# EAGLE design Rauchmelder 2.2 (EAGLE 6.2)
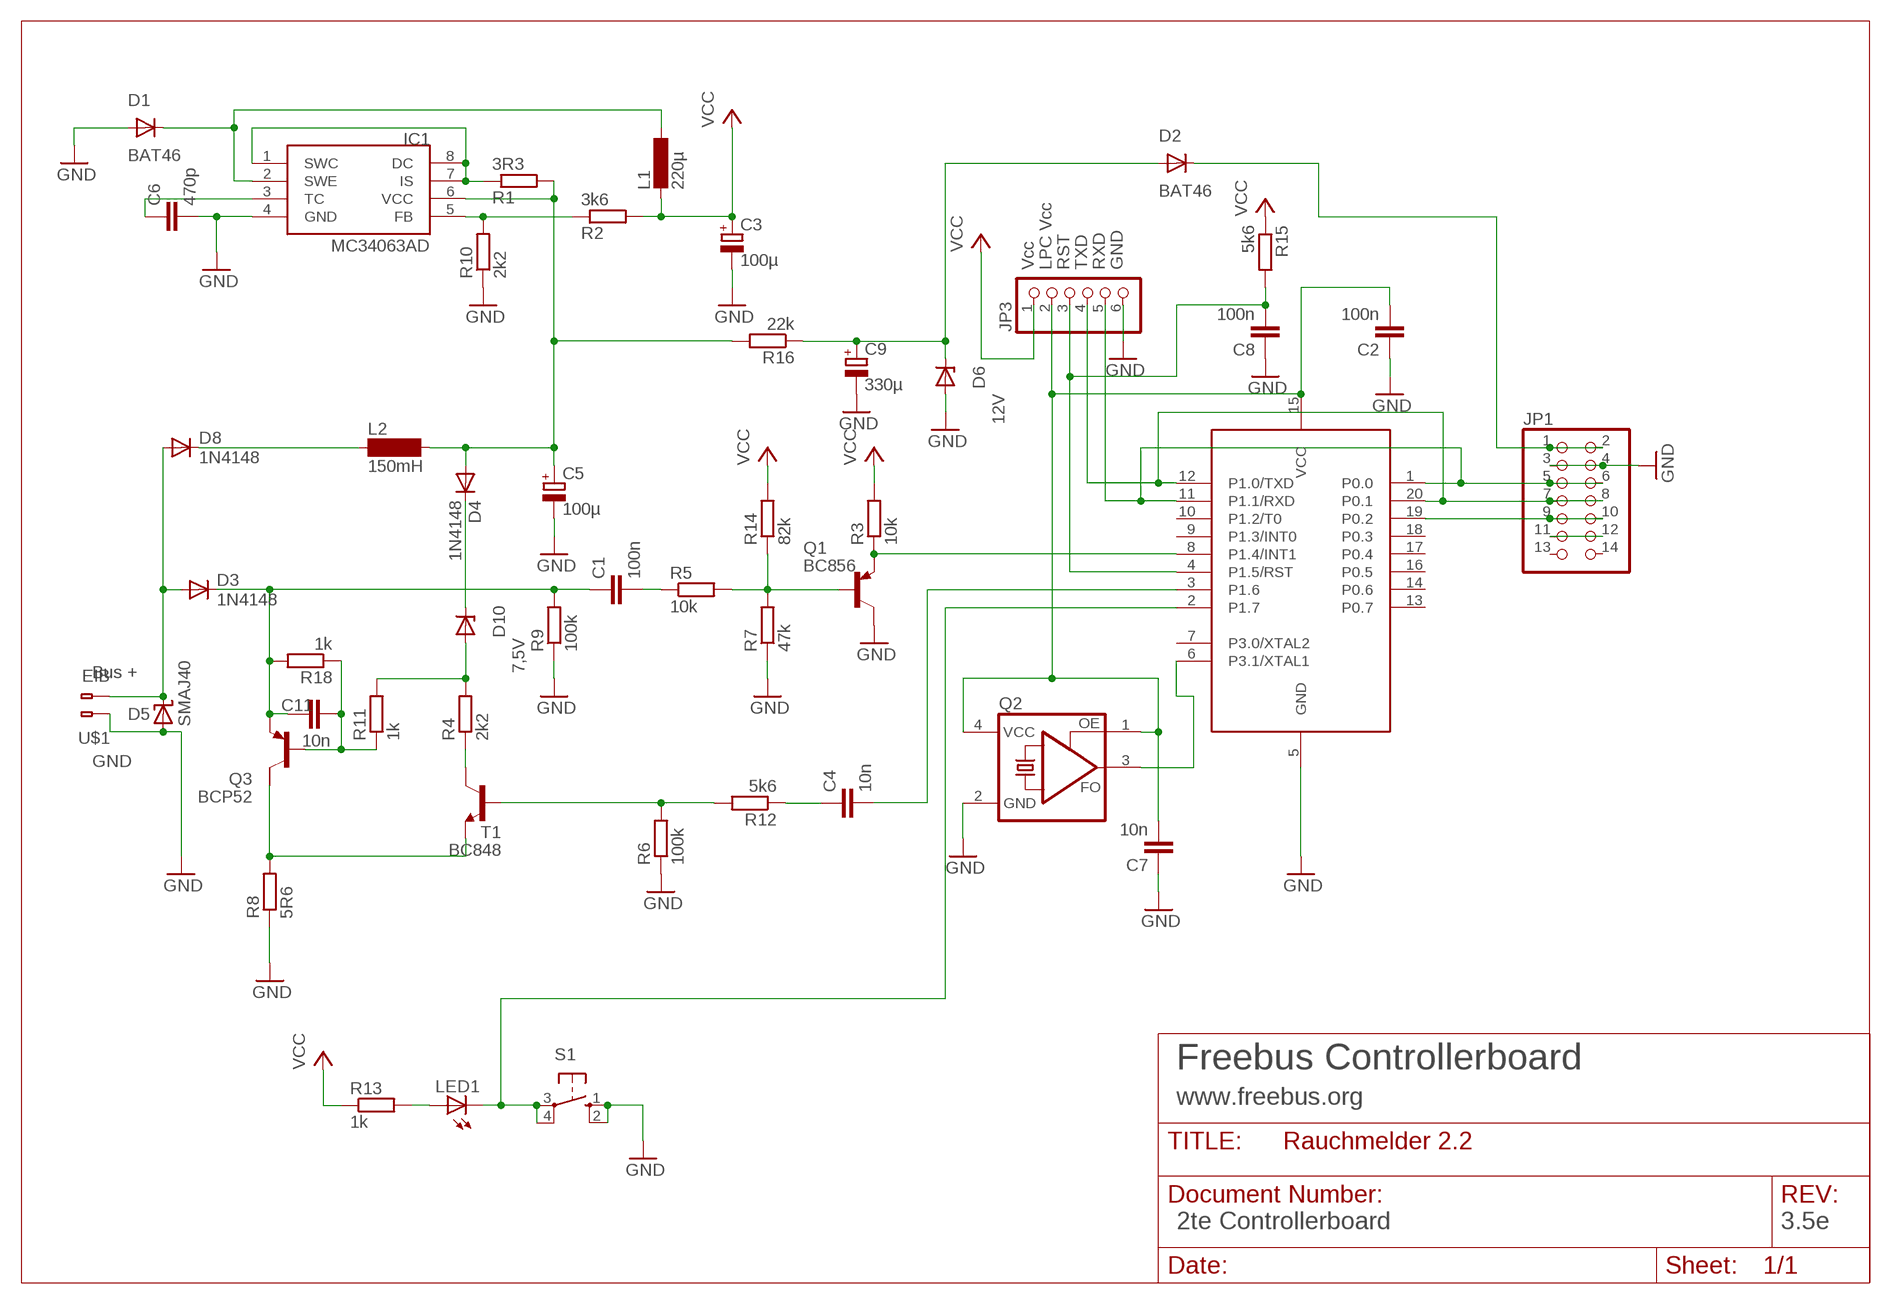
[diagram p0: schematic, sheet 1]

## Parts
C1  100n  C-EUC1206  [C1206]
C2  100n  C-EUC1206  [C1206]
C3  100µ  CPOL-EUSANYO_SMD_B6  [SANYO-OSCON_SMD_B6]
C4  10n  C-EUC1206  [C1206]
C5  100µ  CPOL-EUSANYO_SMD_C6  [SANYO-OSCON_SMD_C6]
C6  470p  C-EUC1206  [C1206]
C7  10n  C-EUC1206  [C1206]
C8  100n  C-EUC1206  [C1206]
C9  330µ  CPOL-EUE3.5-8  [E3,5-8]
C11  10n  C-EUC1206  [C1206]
D1  BAT46  DIODE-MINIMELF  [MINIMELF]
D2  BAT46  DIODE-MINIMELF  [MINIMELF]
D3  1N4148  DIODE-MINIMELF  [MINIMELF]
D4  1N4148  DIODE-MINIMELF  [MINIMELF]
D5  SMAJ40  SUPPRESSOR-SMBJ  [SMBJ]
D6  12V  ZPD  [MINIMELF]
D8  1N4148  DIODE-MINIMELF  [MINIMELF]
D10  7,5V  ZPD  [MINIMELF]
IC1  MC34063AD  [SOIC8]
IC3  LPC922FDH  [TSSOP20]
JP1  PINHD-2X7  [2X07]
JP3  PINHD-1X6  [1X06]
L1  220µ  L-EU0207/12  [0207/12]
L2  150mH  BS11  [BS11]
LED1  LED3MM  [LED3MM]
Q1  BC856  BC856ALT1SMD  [SOT23-BEC]
Q2  ASFL  [ASF]
Q3  BCP52  FZT753SMD  [SOT223]
R1  3R3  R-EU_R1206  [R1206]
R2  3k6  R-EU_R1206  [R1206]
R3  10k  R-EU_R1206  [R1206]
R4  2k2  R-EU_R1206  [R1206]
R5  10k  R-EU_R1206  [R1206]
R6  100k  R-EU_R1206  [R1206]
R7  47k  R-EU_R1206  [R1206]
R8  5R6  R-EU_R1206  [R1206]
R9  100k  R-EU_R1206  [R1206]
R10  2k2  R-EU_R1206  [R1206]
R11  1k  R-EU_R1206  [R1206]
R12  5k6  R-EU_R1206  [R1206]
R13  1k  R-EU_R1206  [R1206]
R14  82k  R-EU_R1206  [R1206]
R15  5k6  R-EU_R1206  [R1206]
R16  22k  R-EU_R1206  [R1206]
R18  1k  R-EU_R1206  [R1206]
S1  10-XX  [B3F-10XX]
T1  BC848  [SOT23]
U$1  EIB  [BUSKLEMME243-724]

## Nets
EIB+: D3.A D5.C D8.A U$1.2(B-2)
GND: C2.1 C3.- C5.- C6.2 C7.1 C8.1 C9.- D1.A D5.A D6.A IC1.4(GND) IC3.5(GND) JP1.3 JP1.4 JP3.6 Q1.C Q2.2(GND) R6.1 R7.1 R8.1 R9.1 R10.1 S1.1(S) S1.2(S1) U$1.1(B-1)
N$1: IC3.8(P1.4/INT1) Q1.E R3.1
N$2: Q1.B R5.2 R7.2 R14.1
N$3: IC3.6(P3.1/XTAL1) Q2.3(FO)
N$4: C11.2 Q3.1(B) R11.1 R18.1
N$5: C4.2 IC3.3(P1.6)
N$6: C2.2 C7.2 IC3.15(VCC) JP3.2 Q2.1(OE) Q2.4(VCC)
N$7: IC3.2(P1.7) LED1.K(C) S1.3(P) S1.4(P1)
N$8: IC1.1(SWC) IC1.7(IS) IC1.8(DC) R1.1
N$9: LED1.A R13.2
N$10: C9.+ D2.A D6.C R16.1
N$11: IC1.5(FB) R2.1 R10.2
N$12: D1.C IC1.2(SWE) L1.1
N$13: D8.C L2.1
N$14: C6.1 IC1.3(TC)
N$15: D4.C D10.C
N$16: C1.2 R5.1
N$17: C5.+ D4.A IC1.6(VCC) L2.2 R1.2 R16.2
N$18: D2.C JP1.1 JP1.2
N$19: C8.2 IC3.4(P1.5/RST) JP3.3 R15.2
N$21: IC3.19(P0.2) JP1.9 JP1.10
N$22: C4.1 R12.1
N$23: R4.1 T1.3(C)
N$24: JP1.11 JP1.12
N$25: D10.A R4.2 R11.2
N$26: Q3.2(C) R8.2 T1.2(E)
N$33: C1.1 C11.1 D3.C Q3.3(E) R9.2 R18.2
N$34: R6.2 R12.2 T1.1(B)
RX: IC3.1(P0.0) IC3.11(P1.1/RXD) JP1.5 JP1.6 JP3.5
TX: IC3.12(P1.0/TXD) IC3.20(P0.1) JP1.7 JP1.8 JP3.4
VCC: C3.+ JP3.1 L1.2 R2.2 R3.2 R13.1 R14.2 R15.1
Unconnected: IC3.7(P3.0/XTAL2) IC3.9(P1.3/INT0) IC3.10(P1.2/T0) IC3.13(P0.7) IC3.14(P0.6) IC3.16(P0.5) IC3.17(P0.4) IC3.18(P0.3) JP1.13 JP1.14 Q3.4(C/)

## Notes on the sheet
- Vcc | LPC Vcc | RST | TXD | RXD | GND
- Bus +
- GND
- Freebus Controllerboard
- www.freebus.org
- 2te Controllerboard | 3.5e

## Library data of the parts
C1 C2 C4 C6-C8 C11 = rcl:C-EU: CAPACITOR, European symbol
C3 C5 C9 = rcl:CPOL-EU: POLARIZED CAPACITOR, European symbol
D1-D4 D8 = diode:DIODE-: DIODE
D5 = diode:SUPPRESSOR-: Suppressor diode
D6 D10 = diode:ZPD: Z DIODE 500 mW
IC1 = mc34063:MC34063
IC3 = LPCGira:LPC922FDH
JP1 = pinhead:PINHD-2X7: PIN HEADER
JP3 = pinhead:PINHD-1X6: PIN HEADER
L1 = rcl:L-EU: INDUCTOR, European symbol
L2 = inductor-neosid:BS: INDUCTOR nominal inductance, magnetically screened
LED1 = led:LED: LED OSRAM: - CHIPLED LG R971, LG N971, LY N971, LG Q971, LY Q971, LO R971, LY R971 LH N974, LH R974 LS Q976, LO Q976, LY Q976 LO Q996 - Hyper CHIPLED LW Q18S LB Q993, LB Q99A, LB R99A - SideLED LS A670, LO A670, LY A670, LG A670, LP A670 LB A673, LV A673, LT A673, LW A673 LH A674 LY A675 LS A676, LA A676, LO A676, LY A676, LW A676 LS A679, LY A679, LG A679 - Hyper Micro SIDELED® LS Y876, LA Y876, LO Y876, LY Y876 LT Y87S - SmartLED LW L88C, LW L88S LB L89C, LB L89S, LG L890 LS L89K, LO L89K, LY L89K LS L896, LA L896, LO L896, LY L896 - TOPLED LS T670, LO T670, LY T670, LG T670, LP T670 LSG T670, LSP T670, LSY T670, LOP T670, LYG T670 LG T671, LOG T671, LSG T671 LB T673, LV T673, LT T673, LW T673 LH T674 LS T676, LA T676, LO T676, LY T676, LB T676, LH T676, LSB T676, LW T676 LB T67C, LV T67C, LT T67C, LS T67K, LO T67K, LY T67K, LW E67C LS E67B, LA E67B, LO E67B, LY E67B, LB E67C, LV E67C, LT E67C LW T67C LS T679, LY T679, LG T679 LS T770, LO T770, LY T770, LG T770, LP T770 LB T773, LV T773, LT T773, LW T773 LH T774 LS E675, LA E675, LY E675, LS T675 LS T776, LA T776, LO T776, LY T776, LB T776 LHGB T686 LT T68C, LB T68C - Hyper Mini TOPLED® LB M676 - Mini TOPLED Santana® LG M470 LS M47K, LO M47K, LY M47K Source: http://www.osram.convergy.de - LUMILED® LXK2-PW12-R00, LXK2-PW12-S00, LXK2-PW14-U00, LXK2-PW14-V00 LXK2-PM12-R00, LXK2-PM12-S00, LXK2-PM14-U00 LXK2-PE12-Q00, LXK2-PE12-R00, LXK2-PE12-S00, LXK2-PE14-T00, LXK2-PE14-U00 LXK2-PB12-K00, LXK2-PB12-L00, LXK2-PB12-M00, LXK2-PB14-N00, LXK2-PB14-P00, LXK2-PB14-Q00 LXK2-PR12-L00, LXK2-PR12-M00, LXK2-PR14-Q00, LXK2-PR14-R00 LXK2-PD12-Q00, LXK2-PD12-R00, LXK2-PD12-S00 LXK2-PH12-R00, LXK2-PH12-S00 LXK2-PL12-P00, LXK2-PL12-Q00, LXK2-PL12-R00 Source: www.luxeon.com
Q1 = transistor-pnp:BC856*: PNP Transistror
Q2 = crystal:ASF*: CRYSTAL CLOCK OSCILLATORS 5.0 Vdc or 3.3 Vdc - LOW PROFILE ULTRA MINIATURE CERAMIC SURFACE MOUNT Source: http://www.abracon.com/Oscillators/asf1-L-L1.pdf
Q3 = transistor-pnp:FZT753SMD: PNP Transistor
R1-R16 R18 = rcl:R-EU_: RESISTOR, European symbol
S1 = switch-omron:10-XX: OMRON SWITCH
T1 = transistor:BC848: NPN TRANSISTOR
U$1 = con-wago:EIB

## Board
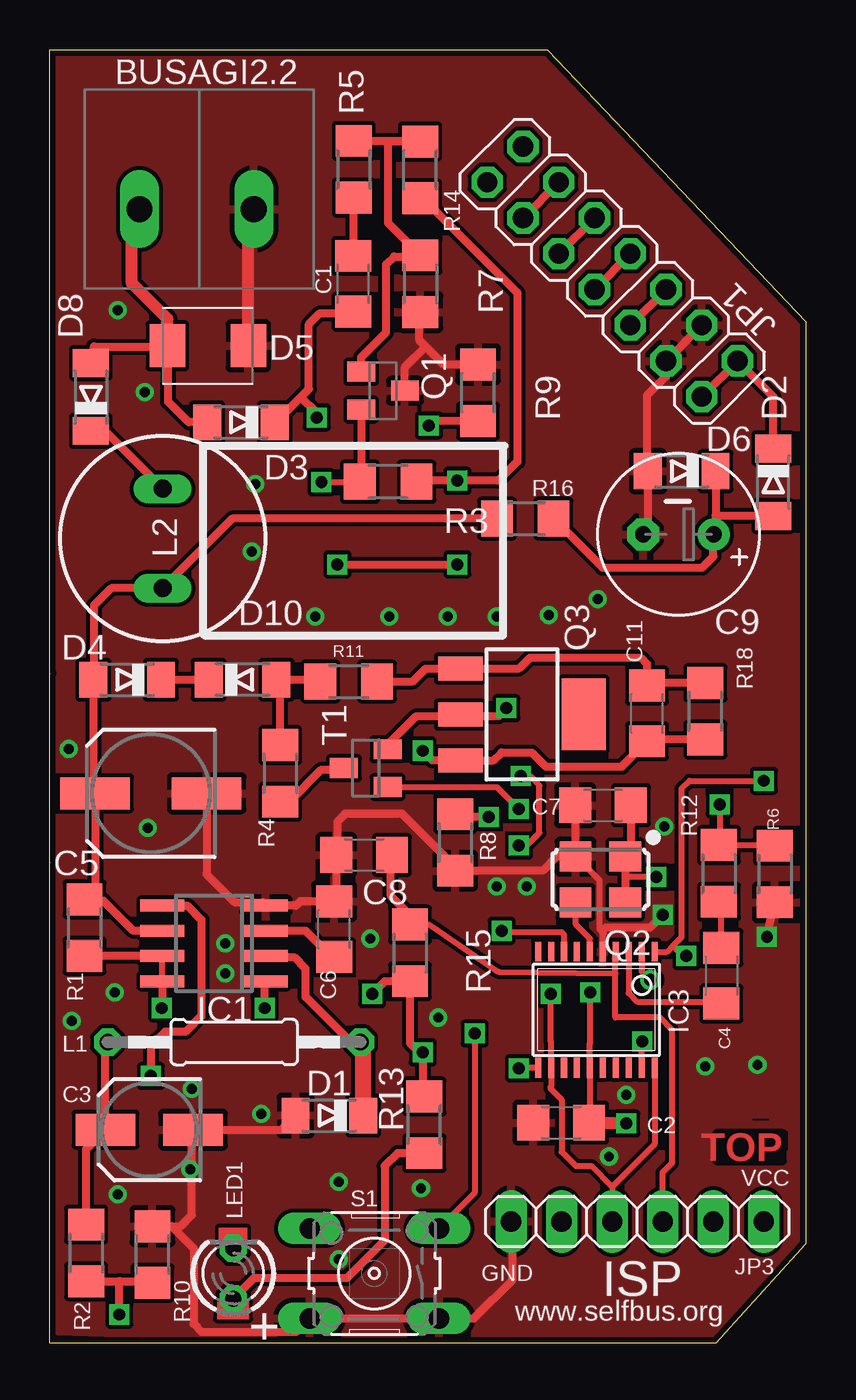
[diagram p1: board, top side]
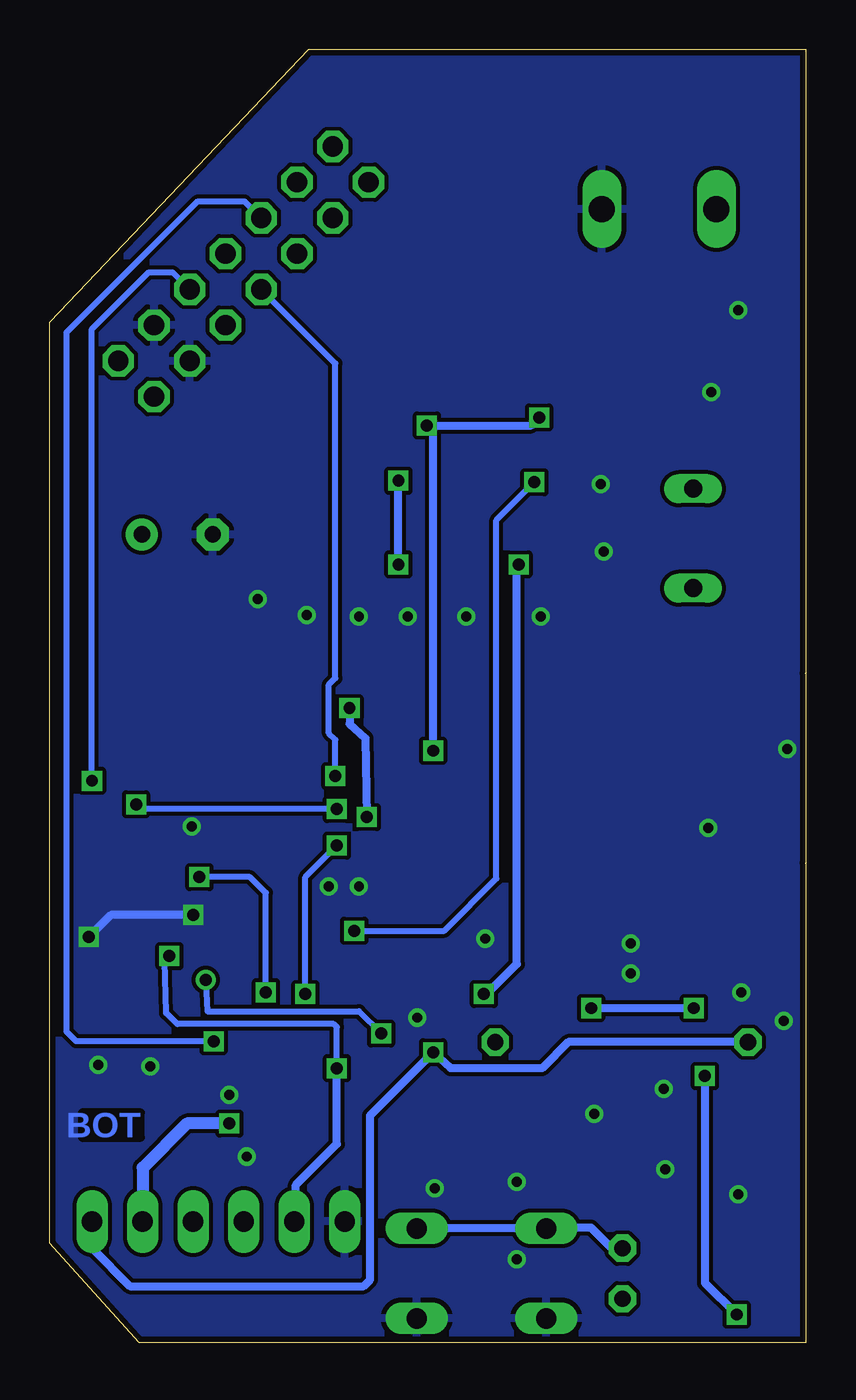
[diagram p2: board, bottom side, seen from below]

Size 38 x 65 mm. Coordinates in mm from the lower left corner, seen from the top.
Outline: 0,33.66 0.04,33.66
Outline: 0.04,24.13 0,24.13
Outline: 0,0 0,65 25,65 38,51.3 38,5 33.5,0 0,0
Copper layers (1*16): Top 0.035mm / dielectric 1.5mm / Bottom 0.035mm
Design rules: minimum track width 10mil, minimum drill 24mil, track to track 8mil, track to pad 8mil, pad to pad 8mil, via to via 8mil, smd to smd 8mil, copper to edge 12mil, drill to drill 8mil, minimum pad ring 11mil, minimum via ring 8mil, stop-mask expansion 4mil, vias tented up to drill 0mil, thermal gap 10mil
tRestrict: area 35.3,11.2 to 36.1,11.3; area 35.4,9 to 36.2,9.1; area 37,9.7 to 37.1,10.6

### Footprints (pad centres in the part's own frame; a part is rotated, then mirrored left to right if it is on the bottom)
C1206 = smd 1.6 x 1.8: 1 -1.4,0; 2 1.4,0
SANYO-OSCON_SMD_B6 = smd 3 x 1.6: + 2.2,0; - -2.2,0
SANYO-OSCON_SMD_C6 = smd 3.5 x 1.6: + 2.8,0; - -2.8,0
E3,5-8 = drill 0.813 pad 1.6: + -1.778,0 | drill 0.813 pad 1.6 octagon: - 1.778,0
MINIMELF = smd 1.4 x 1.8: A 1.7,0; C -1.7,0
SMBJ = smd 1.78 x 2.16: A 2.04,0; C -2.03,0
SOIC8 = smd 0.6 x 2.2: 1 -1.905,-2.6; 2 -0.635,-2.6; 3 0.635,-2.6; 4 1.905,-2.6; 5 1.905,2.6; 6 0.635,2.6; 7 -0.635,2.6; 8 -1.905,2.6
TSSOP20 = smd 0.305 x 0.991: 1 -2.925,-2.918; 2 -2.275,-2.918; 3 -1.625,-2.918; 4 -0.975,-2.918; 5 -0.325,-2.918; 6 0.325,-2.918; 7 0.975,-2.918; 8 1.625,-2.918; 9 2.275,-2.918; 10 2.925,-2.918; 11 2.925,2.918; 12 2.275,2.918; 13 1.625,2.918; 14 0.975,2.918; 15 0.325,2.918; 16 -0.325,2.918; 17 -0.975,2.918; 18 -1.625,2.918; 19 -2.275,2.918; 20 -2.925,2.918
2X07 = drill 1.016 octagon: 1 -7.62,-1.27; 2 -7.62,1.27; 3 -5.08,-1.27; 4 -5.08,1.27; 5 -2.54,-1.27; 6 -2.54,1.27; 7 0,-1.27; 8 0,1.27; 9 2.54,-1.27; 10 2.54,1.27; 11 5.08,-1.27; 12 5.08,1.27; 13 7.62,-1.27; 14 7.62,1.27
1X06 = drill 1.016 long: 1 -6.35,0; 2 -3.81,0; 3 -1.27,0; 4 1.27,0; 5 3.81,0; 6 6.35,0
0207/12 = drill 0.813 octagon: 1 -6.35,0; 2 6.35,0
BS11 = drill 0.9 long: 1 -2.5,0; 2 2.5,0
LED3MM = drill 0.813 octagon: A -1.27,0; K 1.27,0
SOT23-BEC = smd 1 x 1.4: B -0.95,-1.1; C 0,1.1; E 0.95,-1.1
ASF = smd 1.6 x 1.5: 1 -1.25,-1.15; 2 1.25,-1.15; 3 1.25,1.15; 4 -1.25,1.15
SOT223 = smd 1.219 x 2.235: 1 -2.311,-3.099; 2 0,-3.099; 3 2.311,-3.099 | smd 3.6 x 2.2: 4 0,3.099
R1206 = smd 1.6 x 1.803: 1 -1.422,0; 2 1.422,0
B3F-10XX = drill 1.016 long: 1 -3.251,2.261; 2 3.251,2.261; 3 -3.251,-2.261; 4 3.251,-2.261
SOT23 = smd 1 x 1.4: 1 -0.95,-1.1; 2 0.95,-1.1; 3 0,1.1
BUSKLEMME243-724 = drill 1.3 long: 1 -2.875,0; 2 2.875,0

### Placement (x,y rotation side)
C1  15.24,53.24 90 top
C2  25.69,11.07 0 top
C3  5,10.72 180 top
C4  33.75,18.46 270 top
C5  5.08,27.62 180 top
C6  14.29,20.8 90 top
C7  27.8,27.03 0 top
C8  15.8,24.53 0 top
C9  31.59,40.64 180 top
C11  30.01,31.64 90 top
D1  14.05,11.43 180 top
D2  36.35,43.26 270 top
D3  9.6,46.28 180 top
D4  3.89,33.34 180 top
D5  7.94,50.12 0 top
D6  31.75,43.81 180 top
D8  2.06,47.55 90 top
D10  9.68,33.34 0 top
IC1  8.26,20.08 90 top
IC3  27.46,16.75 180 top
JP1  28.27,53.85 135 top
JP3  29.53,6.1 180 top
L1  9.26,15.12 180 top
L2  5.67,40.44 270 top
LED1  9.22,3.49 90 top
Q1  16.75,47.86 270 top
Q2  27.67,23.3 180 top
Q3  23.73,31.59 270 top
R1  1.75,20.88 90 top
R2  1.83,4.52 90 top
R3  17,43.29 0 top
R4  11.58,28.63 90 top
R5  15.28,58.99 90 top
R6  36.43,23.57 90 top
R7  18.62,53.24 90 top
R8  20.38,25.16 90 top
R9  21.52,47.76 270 top
R10  5.16,4.44 270 top
R11  15.02,33.25 180 top
R12  33.62,23.6 90 top
R13  18.82,10.96 270 top
R14  18.61,58.96 270 top
R15  18.1,19.61 90 top
R16  23.89,41.43 180 top
R18  32.94,31.75 270 top
S1  16.31,3.49 180 top
T1  15.88,28.89 90 top
U$1  7.38,56.99 180 top

### Tracks (layer width: path | path; a pad name or v marks a point on that pad's centre or on a via)
EIB+
  Top 0.406: D8.A 2.22,49.25 2.22,50.09 5.91,50.09 D5.C 5.95,50.07 5.95,47.31 6.99,46.28 D3.A
  Top 0.61: D5.C 5.91,51.48 4.13,53.26 4.13,57.48 U$1.2
GND  (via drill 0.5, 0.6)
  Top 0.305: IC3.5 27.79,20.63 27.62,20.8 27.62,23.24 Q2.2
  Top 0.406: C9.- 30.05,40.88 D6.A 30,43.86 30,47.62 30.96,48.59 JP1.4 JP1.3 | C5.- 7.88,23.55 9.29,22.15 10.7,22.15 IC1.4 12.38,21.99 12.59,22.2 C6.2 14.4,22.3 C8.1 14.45,24.89 14.45,26.19 14.84,26.59 17.7,26.59 20.3,24 R8.1 20.93,23.73 24.77,23.73 25.48,24.45 Q2.2 26.42,27 C7.1 | D1.A 11.64,10.72 C3.- 7.14,10.66 7.14,6.43 6.58,5.87 6.12,5.87 | JP3.6 23.26,6.02 23.26,3.17 21.31,1.23 S1.1 S1.2 12.38,0.56 7.62,0.56 7.22,0.95 7.22,4.76 6.12,5.87 | R9.1 19.8,49.18 18.89,50.09 | 18.89,50.09 18.57,50.4 18.57,51.77 R7.1 | Q1.C 17.85,49.04 18.89,50.09 | R10.1 6.12,5.87 | 27.79,20.63 27.79,20.72 27.94,20.88 30.16,20.88 v30.8,21.51 | v36.04,20.4 R6.1 | R6.1
  Top 0.61: D5.A 9.98,57.51 U$1.1
  Bottom 0.406: v30.8,21.51 34.93,21.51 v36.04,20.4
  other vias: 28.97,12.46 28.1,9.37 10.32,43.18 10.16,39.77 3.41,51.91 4.76,47.78 27.54,37.39 0.95,29.84 4.92,25.88 3.25,17.62 1.11,16.19 3.41,7.46 7.06,8.73 7.14,12.78 10.64,11.51 14.53,4.21 14.53,8.1 18.65,7.78 19.53,16.35 16.11,20.32 32.94,13.89 35.56,13.97 23.97,22.94 30.88,25.96 22.46,22.94 8.81,18.57 8.81,20.08 13.34,36.51 17.07,36.51 20,36.51 22.46,36.51 25.08,36.59
  pour Top: -1.2,0.6 -1.2,66.1 -0.7,66.6 25.9,66.6 39.9,52.6 39.9,2.7 36.6,-0.6
  pour Bottom: -0.7,66.7 26.3,66.7 40.4,52.6 40.4,3.1 35.9,-1.4 -0.5,-1.4 -1.7,-0.2
N$1  (via drill 0.6)
  Top 0.305: IC3.8 25.84,20.52 25.72,20.64 22.78,20.64 v22.7,20.72 | v13.65,43.26 15.55,43.26 R3.1
  Top 0.406: Q1.E 15.65,43.36 R3.1
  Bottom 0.305: v22.7,20.72 18.18,20.72 15.56,23.34 15.56,41.35 v13.65,43.26
N$2
  Top 0.406: R5.2 18.61,60.42 R14.1 17,60.39 16.99,60.4 16.99,56.3 18.27,55.02 | 18.27,55.02 R7.2 | Q1.B 15.65,49.54 16.91,50.8 16.91,54.21 17.3,54.61 17.86,54.61 18.27,55.02
N$3
  Top 0.305: IC3.6 27.14,20.33 26.43,21.03 26.43,22.13 Q2.3
N$4
  Top 0.406: R18.1 30.14,33.17 C11.2 30,34.13 29.69,34.45 24.13,34.45 23.58,33.9 Q3.1 18.89,33.89 18.24,33.25 R11.1
N$5
  Top 0.305: IC3.3 29.09,17.58 29.53,17.14 33.66,17.14 C4.2
N$6  (via drill 0.6)
  Top 0.305: v27.15,17.62 27.15,15.08 27.14,15.07 IC3.15 27.14,11.12 C2.2 | v30.48,23.42 28.92,23.42
  Top 0.406: C7.2 29.2,24.73 Q2.1 28.92,23.42 Q2.4
  Top 0.61: C2.2 28.93,11.07 v28.97,11.03
  Bottom 0.305: v27.15,17.62 27.15,22.62 27.94,23.42 v30.48,23.42
  Bottom 0.61: v28.97,11.03 31.12,11.03 33.34,8.81 JP3.2 | JP3.2
N$7  (via drill 0.6)
  Top 0.305: IC3.2 29.74,18.68 v30.16,18.26 | v21.35,15.56 21.35,7.54 S1.3
  Bottom 0.305: v30.16,18.26 30.16,18.1 30.08,16.67 22.46,16.67 v21.35,15.56
  Bottom 0.406: LED1.K 9.76,4.76 10.8,5.79 13.02,5.79 S1.4 S1.3
N$8  (via drill 0.6)
  Top 0.305: IC1.8 IC1.7
  Top 0.406: IC1.7 R1.1 | IC1.8 5.66,17.24 v5.64,16.83 | v10.8,16.83 10.8,18.12 IC1.1
  Bottom 0.406: v5.64,16.83 v10.8,16.83
N$9
  Top 0.406: R13.2 17.48,9.54 16.83,8.89 16.83,5.16 14.92,3.25 10.26,3.25 LED1.A
N$10
  Top 0.406: D6.C 33.45,41.59 | 33.45,41.59 33.45,40.72 C9.+ 33.34,40.61 33.34,39.53 32.78,38.97 27.78,38.97 25.32,41.43 R16.1 | D2.A 33.48,41.56 33.45,41.59
N$11  (via drill 0.6)
  Top 0.406: IC1.5 6.91,21.99 7.62,21.27 7.62,16.43 6.83,15.64 5.79,15.64 5.08,14.92 v5.08,13.41 | R2.1 3.49,3.1 | 3.49,3.1 5.08,3.1 R10.2 | v3.49,1.43 3.49,3.1
  Bottom 0.406: v5.08,13.41 5.08,3.02 v3.49,1.43
N$12
  Top 0.406: 15.75,14.99 L1.1 15.12,15.12 12.86,17.38 12.86,18.81 12.3,19.37 10.93,19.37 IC1.2
  Top 0.813: D1.C 15.75,14.99
N$13
  Top 0.406: D8.C 2.77,45.85 L2.1
N$14
  Top 0.406: C6.1 14.18,19.4 12.86,20.72 IC1.3
N$15
  Top 0.406: D4.C D10.C
N$16
  Top 0.406: R5.1 15.24,57.57 C1.2
N$17
  Top 0.406: R16.2 9.17,41.43 L2.2 3.09,37.94 2.22,37.07 2.22,33.37 D4.A 2.19,27.71 C5.+ 2.28,22.83 R1.2 1.82,22.23 2.7,22.23 4.21,20.72 IC1.6
N$18
  Top 0.406: D2.C 36.35,47.56 JP1.1 JP1.2
N$19
  Top 0.305: R15.2 19.06,21.03 22.54,18.65 28.42,18.57 | 28.42,18.57 28.42,19.64 IC3.4 | JP3.3 30.8,8.57 31.27,9.05 31.27,15.72 30.64,16.35 28.42,16.35 28.42,18.57
  Top 0.406: R15.2 18.1,21.51 17.15,22.46 17.15,24.79 C8.2
N$21  (via drill 0.6)
  Top 0.305: IC3.19 29.74,15.13 v29.77,15.16
  Top 0.406: JP1.9 JP1.10
  Bottom 0.305: v29.77,15.16 36.67,15.16 37.15,15.64 37.15,50.8 30.56,57.39 28.22,57.39 JP1.9
N$22
  Top 0.305: C4.1 33.75,22.05 R12.1
N$23
  Top 0.406: R4.1 12.05,27.21 13.65,28.81 14.7,28.81 T1.3
N$24
  Top 0.406: JP1.11 JP1.12
N$25
  Top 0.406: R11.2 13.5,33.34 D10.A 11.58,33.14 R4.2
N$26  (via drill 0.6)
  Top 0.406: T1.2 16.98,30.07 18.42,31.51 20.56,31.51 | 20.56,31.51 Q3.2 | 20.56,31.51 22.54,31.51 v22.94,31.91 | v22.07,26.43 21.08,26.43 R8.2
  Bottom 0.406: v22.94,31.91 22.94,31.11 22.15,30.4 v22.07,26.43
N$33  (via drill 0.6)
  Top 0.406: D3.C 11.35,46.28 12.62,47.55 | 12.62,47.55 13.02,47.94 13.02,51.2 13.57,51.75 15.16,51.75 C1.1 | R18.2 30.1,30.33 C11.1 28.74,28.97 24.92,28.97 24.22,29.68 22.7,29.69 22.3,29.28 Q3.3 19.21,29.29 v18.73,29.77 | R9.2 19.27,46.34 v19.05,46.12 | v13.41,46.51 13.41,46.75 12.62,47.55
  Bottom 0.406: v13.41,46.51 13.81,46.12 v19.05,46.12 18.73,45.8 v18.73,29.77
N$34  (via drill 0.6)
  Top 0.305: R6.2 33.65,25 R12.2 33.66,25.06 v33.66,27.07 | T1.1 22.46,27.94 v23.57,26.83
  Bottom 0.305: v23.57,26.83 33.42,26.83 v33.66,27.07
RX  (via drill 0.6)
  Top 0.305: v25.64,6.18 JP3.5 | IC3.1 31.02,19.67 31.31,19.96 | 31.31,19.96 31.75,20.4 31.75,27.86 32.15,28.26 v35.88,28.26 | IC3.11 23.59,13.83 v23.57,13.81 | v31.99,19.45 31.83,19.45 31.31,19.96
  Top 0.406: JP1.5 JP1.6
  Bottom 0.305: v23.57,13.81 23.57,15.88 23.73,16.03 31.59,16.03 32.15,16.59 32.23,19.21 v31.99,19.45 | v35.88,28.26 35.88,50.96 33.02,53.82 31.83,53.82 JP1.5
  Bottom 0.406: v25.64,6.18 25.64,7.94 23.57,10 v23.57,13.81
TX  (via drill 0.6)
  Top 0.305: IC3.20 30.39,9.99 28.26,7.86 | 28.26,7.86 JP3.4 | v25.16,17.54 25.16,15.16 25.19,15.13 IC3.12 25.19,12.89 25.16,12.86 25.16,12.78 25.72,12.22 25.72,9.6 26.43,8.89 27.23,8.89 28.26,7.86 | v23.57,25 23.97,25 24.61,25.64 24.61,28.02 24.13,28.5 v23.65,28.5
  Top 0.406: JP1.7 JP1.8
  Bottom 0.305: v25.16,17.54 25.16,23.42 v23.57,25 | v23.65,28.5 23.65,30.32 23.97,30.64 23.97,33.1 23.65,33.42 23.65,49.23 JP1.8
VCC  (via drill 0.6)
  Top 0.406: R14.2 18.74,57.54 23.5,52.78 23.5,44.29 22.54,43.34 v20.48,43.34 | v20.48,43.34 20,43.34 | 20,43.34 18.48,43.34 R3.2 | R2.2 1.83,9.74 C3.+ 2.8,15.01 L1.2 | 18.38,14.8 18.1,15.08 R15.1 16.83,18.18 v16.19,17.54 | 18.38,14.8 18.73,14.13 18.73,12.47 R13.1 | v18.73,14.61 18.81,14.61 18.38,14.8 | v14.45,39.13 v20.48,39.13 | v20.48,43.34 20.08,43.42 20,43.34
  Bottom 0.406: L1.2 11.94,15.12 13.26,13.81 17.86,13.81 v18.73,14.61 21.91,11.43 21.91,3.17 22.23,2.86 33.97,2.86 35.88,4.76 JP3.1 | v16.19,17.54 16.03,17.54 14.53,19.05 14.53,38.73 v14.45,39.13 | v20.48,39.13 v20.48,43.34
(copper drawn outside any net)
  shapes: Top area x2

### Text on the board
Top: TOP
Bottom: BOT
tPlace: BUSAGI2.2 | +
tNames: VCC | GND | ISP | www.selfbus.org
tValues: 16V